# Altium schematic sheet BlockDiagram.SchDoc
size A4; SheetNumber: 1; SheetTotal: 1
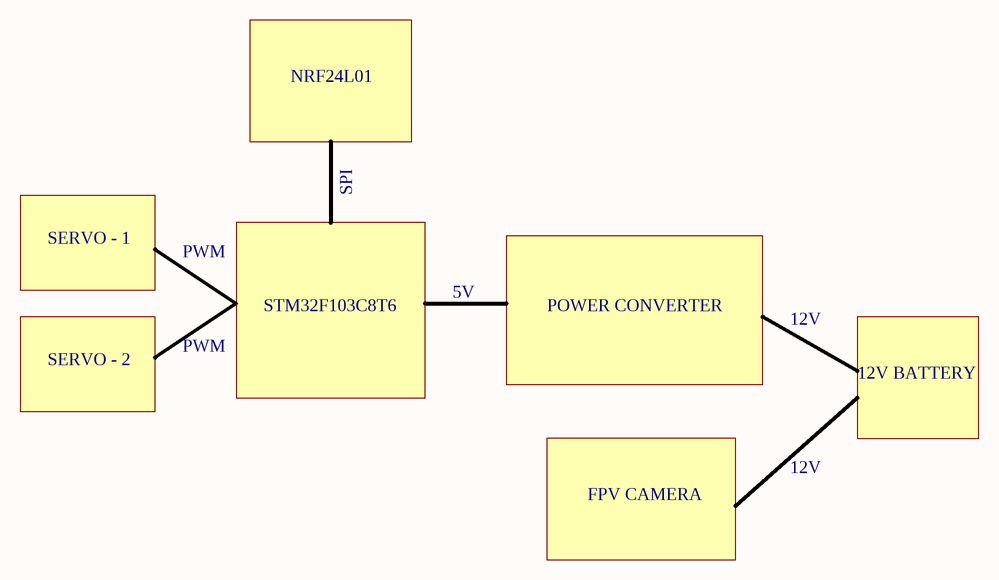
[diagram p0: BlockDiagram.SchDoc]

## Notes on the sheet
- NRF24L01
- SPI
- SERVO - 1
- PWM
- STM32F103C8T6
- 5V
- POWER CONVERTER
- 12V
- SERVO - 2
- 12V BATTERY
- FPV CAMERA